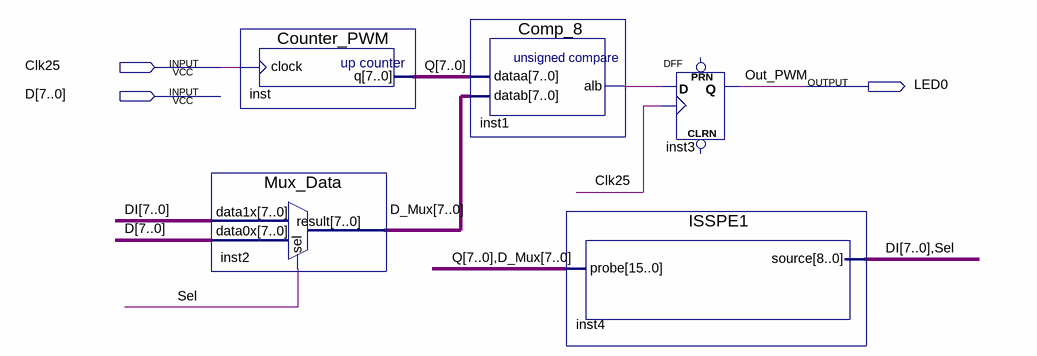
[diagram p0: schematic sheet]
// Quartus schematic Debug_Stp_ISSPE.bdf as structural Verilog: 5 symbols, 3 pins
module Debug_Stp_ISSPE (
  input  Clk25,
  input  [7:0] D,
  output LED0
);

  wire inst1_alb, Sel;
  wire [7:0] D_Mux, DI, Q;

  Counter_PWM inst (.clock(Clk25), .q(Q));
  Mux_Data inst2 (.data1x(DI), .data0x(D), .sel(Sel), .result(D_Mux));
  Comp_8 inst1 (.dataa(Q), .datab(D_Mux), .alb(inst1_alb));
  ISSPE1 inst4 (.probe({Q, D_Mux}), .source({DI, Sel}));
  DFF inst3 (.CLK(Clk25), .D(inst1_alb), .Q(LED0));  // open: CLRN, PRN

  // Other names for the same wires on the sheet: Out_PWM = LED0
endmodule
